# EAGLE design Shematic2 (EAGLE 9.0.0)
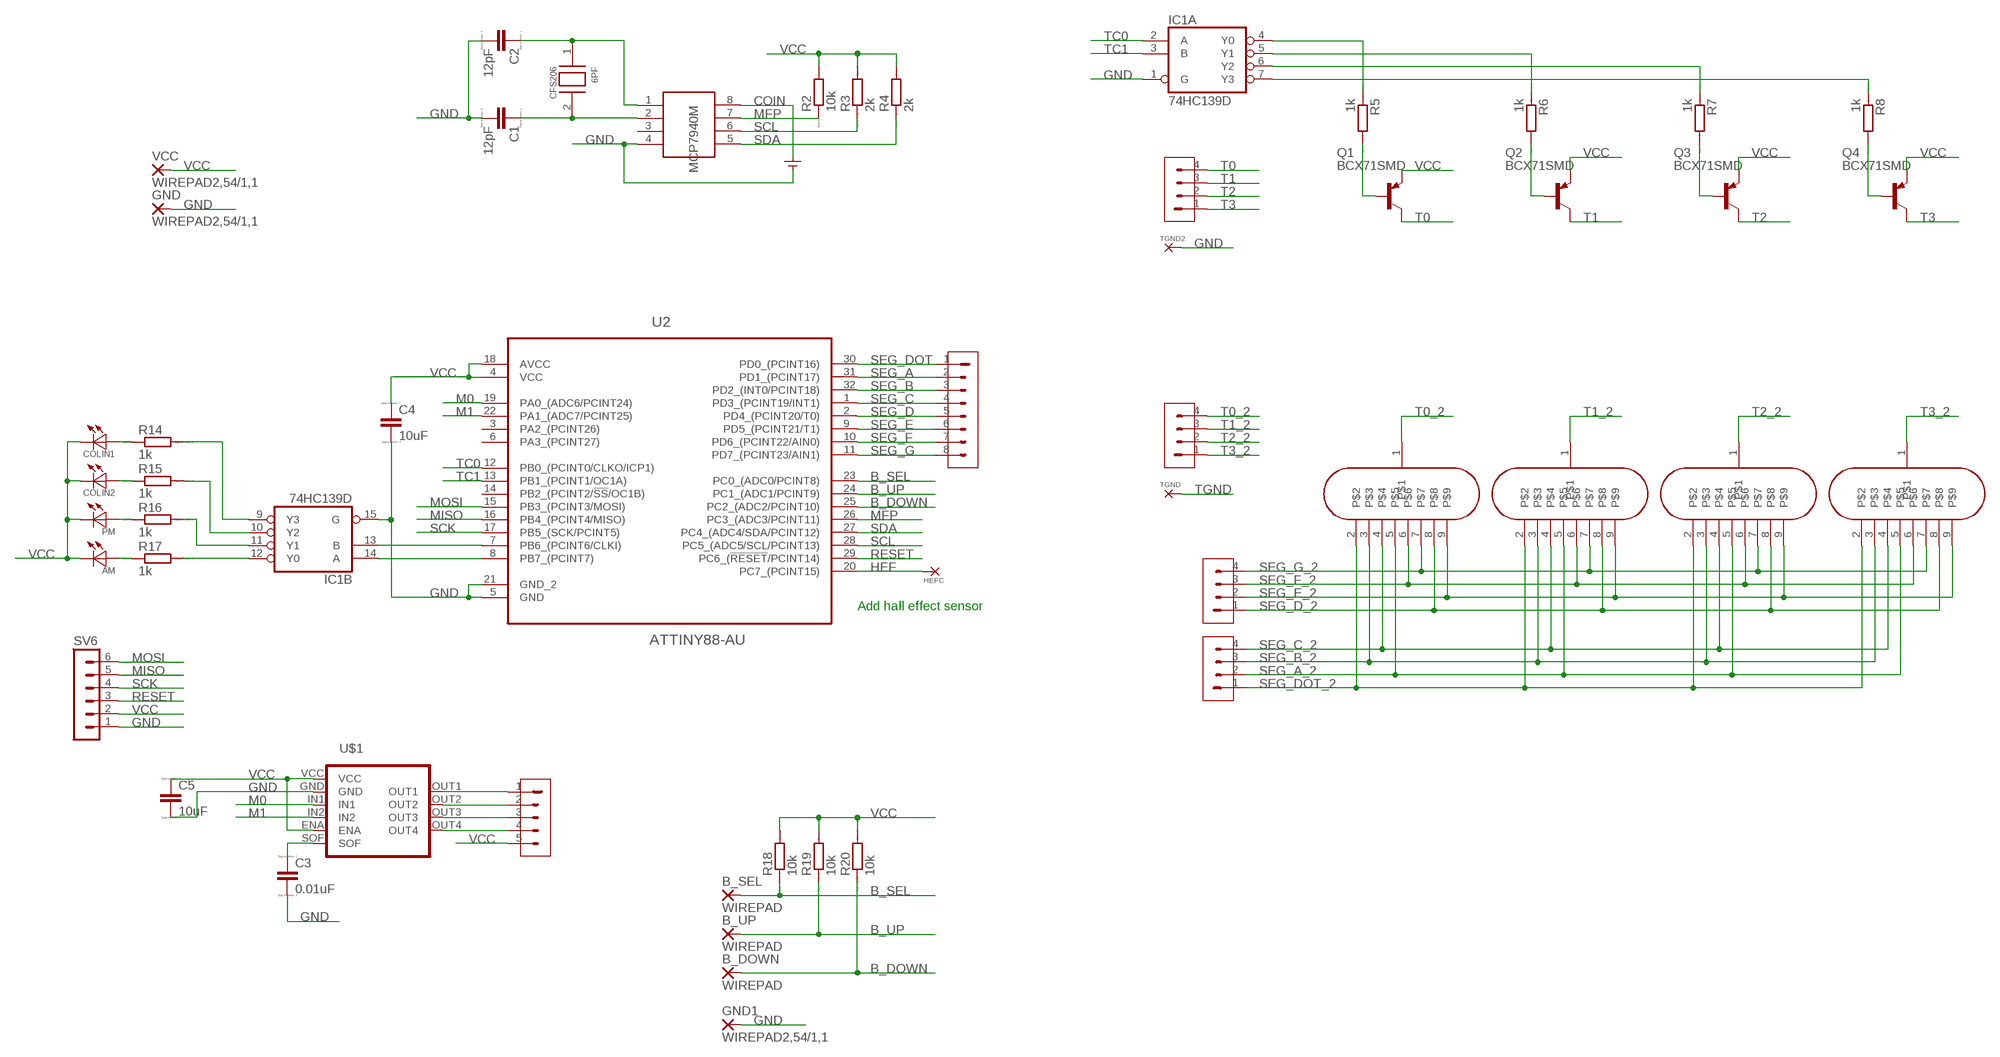
[diagram p0: schematic, sheet 1]

## Parts
6PF  CFS206  [CFS206]
AM  LED  [LED]
B_DOWN  WIREPAD  WIREPAD2,54/1,1  [2,54/1,1]
B_SEL  WIREPAD  WIREPAD2,54/1,1  [2,54/1,1]
B_UP  WIREPAD  WIREPAD2,54/1,1  [2,54/1,1]
C1  12pF  CC1206  [C1206]
C2  12pF  CC1206  [C1206]
C3  0.01uF  CC1206  [C1206]
C4  10uF  CC1206  [C1206]
C5  10uF  CC1206  [C1206]
COLIN1  LED  [LED]
COLIN2  LED  [LED]
GND  WIREPAD2,54/1,1  [2,54/1,1]
GND1  WIREPAD2,54/1,1  [2,54/1,1]
HEFC  H01  [H01]
IC1  74HC139D  [SO16]
MCP7940M  SOIC-8  [SOIC-8]
PM  LED  [LED]
Q1  BCX71SMD  [SOT23]
Q2  BCX71SMD  [SOT23]
Q3  BCX71SMD  [SOT23]
Q4  BCX71SMD  [SOT23]
R2  10k  RR1206  [R1206]
R3  2k  RR1206  [R1206]
R4  2k  RR1206  [R1206]
R5  1k  RR1206  [R1206]
R6  1k  RR1206  [R1206]
R7  1k  RR1206  [R1206]
R8  1k  RR1206  [R1206]
R14  1k  RR1206  [R1206]
R15  1k  RR1206  [R1206]
R16  1k  RR1206  [R1206]
R17  1k  RR1206  [R1206]
R18  10k  RR1206  [R1206]
R19  10k  RR1206  [R1206]
R20  10k  RR1206  [R1206]
SV1  H08  [H08]
SV2  H04  [H04]
SV3  H04  [H04]
SV4  H05  [H05]
SV5  H04  [H04]
SV6  MA06-1  [MA06-1]
SV7  H04  [H04]
TGND  H01  [H01]
TGND2  H01  [H01]
TUBE0  IV-9  [IV-9]
TUBE1  IV-9  [IV-9]
TUBE2  IV-9  [IV-9]
TUBE3  IV-9  [IV-9]
U2  ATTINY88-AU  [QFP80P900X900X120-32N]
U$1  LB1848MC  [LB1848MC]
U$5  COIN  [COIN]
VCC  WIREPAD2,54/1,1  [2,54/1,1]

## Nets
B_DOWN: B_DOWN.1(P) R20.1 U2.25(PC2_(ADC2/PCINT10))
B_SEL: B_SEL.1(P) R18.1 U2.23(PC0_(ADC0/PCINT8))
B_UP: B_UP.1(P) R19.1 U2.24(PC1_(ADC1/PCINT9))
COIN: MCP7940M.8 U$5.V+
GND: C1.2 C2.2 C3.2 C4.2 C5.2 GND1.1(P) GND.1(P) IC1.1(A:G) IC1.15(B:G) MCP7940M.4 SV6.1 TGND2.P$1 U2.5(GND) U2.21(GND_2) U$1.GND U$5.V-
HEF: HEFC.P$1 U2.20(PC7_(PCINT15))
M0: U2.19(PA0_(ADC6/PCINT24)) U$1.IN1
M1: U2.22(PA1_(ADC7/PCINT25)) U$1.IN2
MFP: MCP7940M.7 R2.1 U2.26(PC3_(ADC3/PCINT11))
MISO: SV6.5 U2.16(PB4_(PCINT4/MISO))
MOSI: SV6.6 U2.15(PB3_(PCINT3/MOSI))
N$1: Q4.1(B) R8.2
N$2: Q3.1(B) R7.2
N$3: Q2.1(B) R6.2
N$4: 6PF.2 C1.1 MCP7940M.2
N$5: Q1.1(B) R5.2
N$6: 6PF.1 C2.1 MCP7940M.1
N$7: COLIN1.P$1 R14.1
N$8: IC1.4(A:Y0) R5.1
N$9: COLIN2.P$1 R15.1
N$10: IC1.5(A:Y1) R6.1
N$11: IC1.6(A:Y2) R7.1
N$12: PM.P$1 R16.1
N$13: IC1.7(A:Y3) R8.1
N$14: AM.P$1 R17.1
N$15: IC1.12(B:Y0) R17.2
N$16: IC1.11(B:Y1) R16.2
N$17: IC1.10(B:Y2) R15.2
N$18: IC1.9(B:Y3) R14.2
N$19: SV4.4 U$1.OUT4
N$20: SV4.3 U$1.OUT3
N$21: SV4.2 U$1.OUT2
N$22: SV4.1 U$1.OUT1
N$27: IC1.13(B:B) U2.7(PB6_(PCINT6/CLKI))
N$28: IC1.14(B:A) U2.8(PB7_(PCINT7))
N$31: C3.1 U$1.SOF
RESET: SV6.3 U2.29(PC6_(!RESET!/PCINT14))
SCK: SV6.4 U2.17(PB5_(SCK/PCINT5))
SCL: MCP7940M.6 R3.1 U2.28(PC5_(ADC5/SCL/PCINT13))
SDA: MCP7940M.5 R4.1 U2.27(PC4_(ADC4/SDA/PCINT12))
SEG_A: SV1.2 U2.31(PD1_(PCINT17))
SEG_A_2: SV7.2 TUBE0.5 TUBE1.5 TUBE2.5 TUBE3.5
SEG_B: SV1.3 U2.32(PD2_(INT0/PCINT18))
SEG_B_2: SV7.3 TUBE0.3 TUBE1.3 TUBE2.3 TUBE3.3
SEG_C: SV1.4 U2.1(PD3_(PCINT19/INT1))
SEG_C_2: SV7.4 TUBE0.4 TUBE1.4 TUBE2.4 TUBE3.4
SEG_D: SV1.5 U2.2(PD4_(PCINT20/T0))
SEG_D_2: SV2.1 TUBE0.8 TUBE1.8 TUBE2.8 TUBE3.8
SEG_DOT: SV1.1 U2.30(PD0_(PCINT16))
SEG_DOT_2: SV7.1 TUBE0.2 TUBE1.2 TUBE2.2 TUBE3.2
SEG_E: SV1.6 U2.9(PD5_(PCINT21/T1))
SEG_E_2: SV2.2 TUBE0.9 TUBE1.9 TUBE2.9 TUBE3.9
SEG_F: SV1.7 U2.10(PD6_(PCINT22/AIN0))
SEG_F_2: SV2.3 TUBE0.6 TUBE1.6 TUBE2.6 TUBE3.6
SEG_G: SV1.8 U2.11(PD7_(PCINT23/AIN1))
SEG_G_2: SV2.4 TUBE0.7 TUBE1.7 TUBE2.7 TUBE3.7
T0: Q1.3(C) SV5.4
T0_2: SV3.4 TUBE0.1
T1: Q2.3(C) SV5.3
T1_2: SV3.3 TUBE1.1
T2: Q3.3(C) SV5.2
T2_2: SV3.2 TUBE2.1
T3: Q4.3(C) SV5.1
T3_2: SV3.1 TUBE3.1
TC0: IC1.2(A:A) U2.12(PB0_(PCINT0/CLKO/ICP1))
TC1: IC1.3(A:B) U2.13(PB1_(PCINT1/OC1A))
TGND: TGND.P$1
VCC: AM.P$2 C4.1 C5.1 COLIN1.P$2 COLIN2.P$2 PM.P$2 Q1.2(E) Q2.2(E) Q3.2(E) Q4.2(E) R2.2 R3.2 R4.2 R18.2 R19.2 R20.2 SV4.5 SV6.2 U2.4(VCC) U2.18(AVCC) U$1.ENA U$1.VCC VCC.1(P)
Unconnected: MCP7940M.3 U2.3(PA2_(PCINT26)) U2.6(PA3_(PCINT27)) U2.14(PB2_(PCINT2/!SS!/OC1B))

## Notes on the sheet
- Add hall effect sensor

## Power pins joined to a net without a drawn wire
GND: IC1.8(P:GND)
VCC: IC1.16(P:VCC)

## Library data of the parts
6PF = Library:CFS206
AM COLIN1 COLIN2 PM = Library:LED
B_DOWN B_SEL B_UP GND GND1 VCC = wirepad:WIREPAD: Wire PAD connect wire on PCB
C1-C5 = eagle-ltspice:C: CAPACITOR, European symbol; SPICEMODEL: NONE; SPICEPREFIX: C
HEFC TGND TGND2 = Library:H01
IC1 = 74xx-eu:74*139: Dual 2-line to 4-line DECODER/DEMULTIPLEXER
MCP7940M = smd-footprints:SOIC-8
Q1-Q4 = transistor-pnp:BCX71SMD: PNP Transistor
R2-R8 R14-R20 = eagle-ltspice:R: RESISTOR, European symbol; SPICEMODEL: NONE; SPICEPREFIX: R
SV1 = Library:H08
SV2 SV3 SV5 SV7 = Library:H04
SV4 = Library:H05
SV6 = con-lstb:MA06-1: PIN HEADER; OC_FARNELL: unknown; OC_NEWARK: unknown
TUBE0 TUBE1-TUBE3 = Library:IV-9
U2 = Library:ATTINY88-AU: IC, 8BIT MCU, AVR Tiny, 12MHZ, TQFP-32; MPN: ATTINY88-AU; OC_FARNELL: 1704570; OC_NEWARK: 68T3851; PACKAGE: TQFP-32; SUPPLIER: ATMEL
U$1 = Library:LB1848MC
U$5 = Library:COIN

## Board
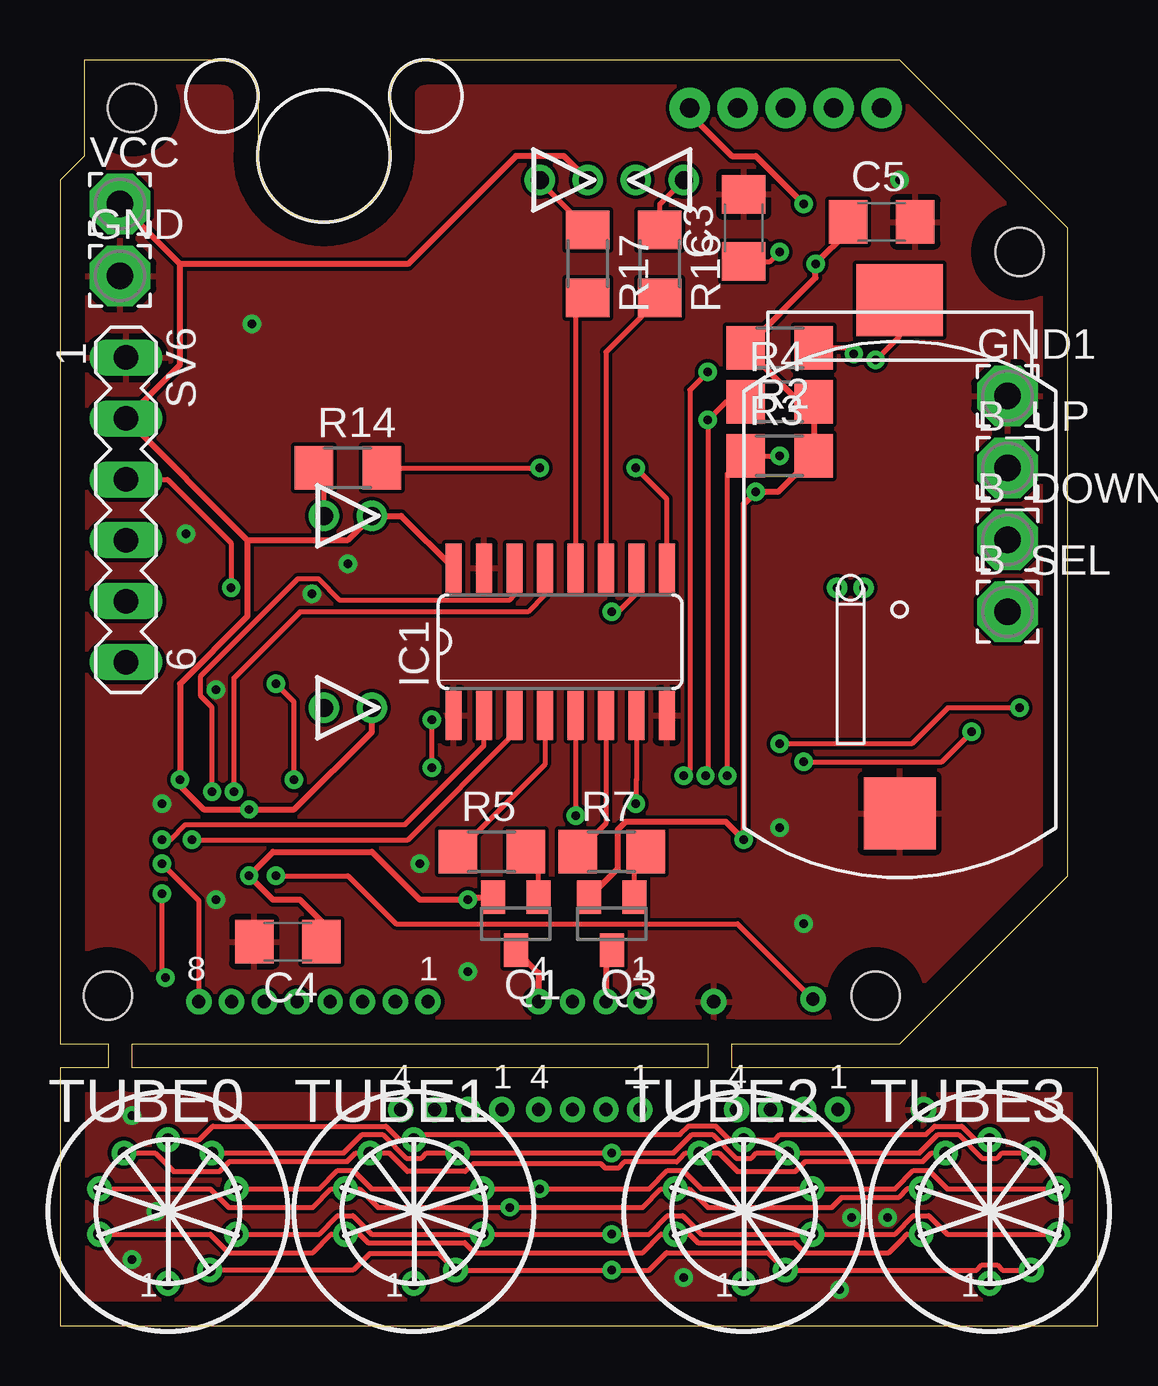
[diagram p1: board, top side]
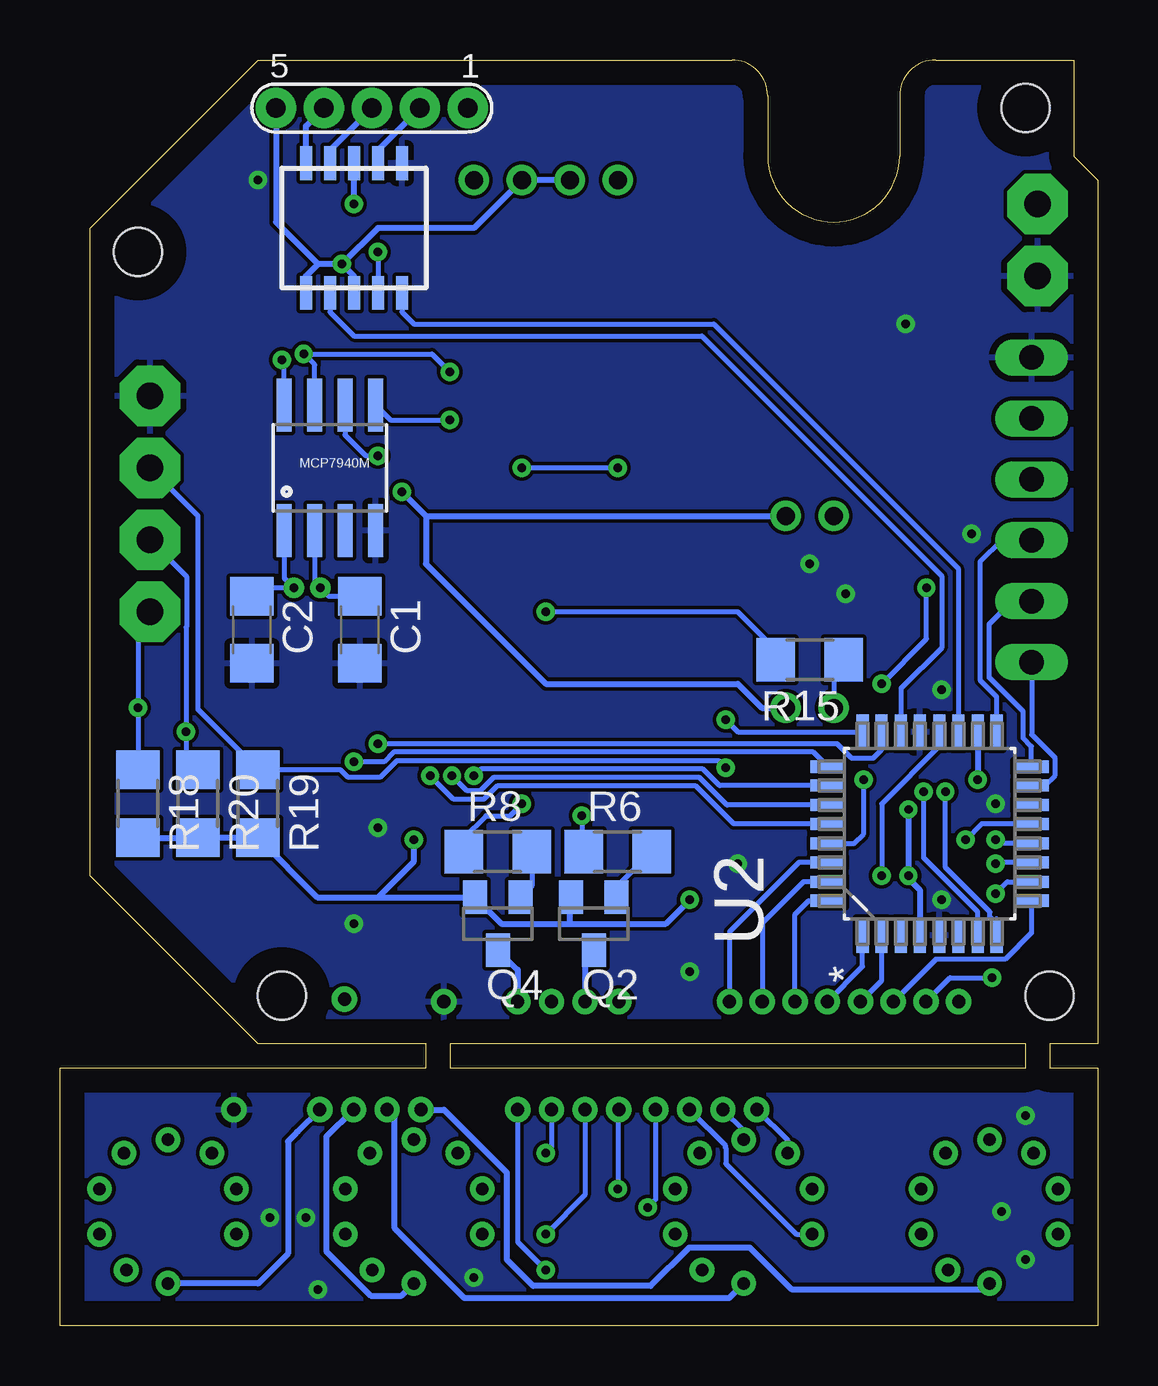
[diagram p2: board, bottom side, seen from below]

Size 43.25 x 52.75 mm. Coordinates in mm from the lower left corner, seen from the top.
Outline: 0,11.75 2,11.75 2,10.75 0,10.75 0,0 43.25,0 43.25,10.75 28,10.75 28,11.75 35,11.75 42,18.75 42,45.75 35,52.75 15.25,52.75 arc90 13.75,51.25 13.75,48.75 arc-180 8.25,48.75 8.25,51.25 arc90 6.75,52.75 1,52.75 1,48.75 0,47.75 0,11.75
Outline: 27,10.75 3,10.75 3,11.75 27,11.75 27,10.75
Copper layers (1*16): Top 0.035mm / dielectric 1.5mm / Bottom 0.035mm
Design rules "default": minimum track width 6mil, minimum drill 0.35mm, track to track 6mil, track to pad 6mil, pad to pad 6mil, via to via 6mil, smd to smd 6mil, copper to edge 40mil, drill to drill 6mil, minimum pad ring 10mil, minimum via ring 8mil, stop-mask expansion 4mil, vias tented up to drill 0mil, thermal gap 10mil
Holes 2 mm at 2,13.75 34,13.75 40,44.75 3,50.75

### Footprints (pad centres in the part's own frame; a part is rotated, then mirrored left to right if it is on the bottom)
CFS206 = drill 0.35: 1 0,0; 2 1.1,0
LED = drill 0.75: P$1 -1,0; P$2 1,0
2,54/1,1 = drill 1.118 pad 2.54 octagon: 1 0,0
C1206 = smd 1.6 x 1.8: 1 -1.4,0; 2 1.4,0
H01 = drill 0.55: P$1 0,0
SO16 = smd 0.66 x 2.032: 1 -4.445,-3.073; 2 -3.175,-3.073; 3 -1.905,-3.073; 4 -0.635,-3.073; 5 0.635,-3.073; 6 1.905,-3.073; 7 3.175,-3.073; 8 4.445,-3.073; 9 4.445,3.073; 10 3.175,3.073; 11 1.905,3.073; 12 0.635,3.073; 13 -0.635,3.073; 14 -1.905,3.073; 15 -3.175,3.073; 16 -4.445,3.073
SOIC-8 = smd 0.61 x 2.21: 1 -1.905,-2.616; 2 -0.635,-2.616; 3 0.635,-2.616; 4 1.905,-2.616; 5 1.905,2.616; 6 0.635,2.616; 7 -0.635,2.616; 8 -1.905,2.616
SOT23 = smd 1 x 1.4: 1 -0.95,-1.1; 2 0.95,-1.1; 3 0,1.1
R1206 = smd 1.6 x 1.803: 1 -1.422,0; 2 1.422,0
H08 = drill 0.55: 1 4.841,0; 2 3.476,0; 3 2.111,0; 4 0.762,0; 5 -0.619,0; 6 -1.984,0; 7 -3.349,0; 8 -4.714,0
H04 = drill 0.55: 1 2.174,0; 2 0.762,0; 3 -0.635,0; 4 -2.048,0
H05 = drill 0.8 pad 1.676: 1 4,0; 2 2,0; 3 0,0; 4 -2,0; 5 -4,0
MA06-1 = drill 1.016 long: 1 -6.35,0; 2 -3.81,0; 3 -1.27,0; 4 1.27,0; 5 3.81,0; 6 6.35,0
IV-9 = drill 0.525: 1 0,-2.994; 2 1.736,-2.441; 3 2.85,-0.943; 4 2.85,0.943; 5 1.836,2.441; 6 0,2.994; 7 -1.836,2.441; 8 -2.85,0.943; 9 -2.85,-0.943
QFP80P900X900X120-32N = smd 1.473 x 0.508: 1 -4.242,2.794; 2 -4.242,2.007; 3 -4.242,1.194; 4 -4.242,0.406; 5 -4.242,-0.406; 6 -4.242,-1.194; 7 -4.242,-2.007; 8 -4.242,-2.794; 17 4.242,-2.794; 18 4.242,-2.007; 19 4.242,-1.194; 20 4.242,-0.406; 21 4.242,0.406; 22 4.242,1.194; 23 4.242,2.007; 24 4.242,2.794 | smd 0.508 x 1.473: 9 -2.794,-4.242; 10 -2.007,-4.242; 11 -1.194,-4.242; 12 -0.406,-4.242; 13 0.406,-4.242; 14 1.194,-4.242; 15 2.007,-4.242; 16 2.794,-4.242; 25 2.794,4.242; 26 2.007,4.242; 27 1.194,4.242; 28 0.406,4.242; 29 -0.406,4.242; 30 -1.194,4.242; 31 -2.007,4.242; 32 -2.794,4.242
LB1848MC = smd 0.5 x 1.4: ENA 0,-2.7; GND 2,2.7; IN1 2,-2.7; IN2 -1,-2.7; OUT1 0,2.7; OUT2 1,2.7; OUT3 -1,2.7; OUT4 -2,2.7; SOF 1,-2.7; VCC -2,-2.7
COIN = smd 3.6 x 3: V+ 0,-1.5 | smd 3 x 3: V- 0,19.9

### Placement (x,y rotation side)
6PF  33.5,30.75 180 top
AM  21,47.75 0 top
B_DOWN  39.5,32.75 0 top
B_SEL  39.5,29.75 0 top
B_UP  39.5,35.75 0 top
C1  30.75,29 270 bottom
C2  35.25,29 270 bottom
C3  28.5,45.75 90 top
C4  9.5,16 180 top
C5  34.25,46 0 top
COLIN1  12,33.75 0 top
COLIN2  12,25.75 0 top
GND  2.5,43.75 0 top
GND1  39.5,38.75 0 top
HEFC  31.39,13.6 0 top
IC1  20.85,28.5 0 top
MCP7940M  32,35.75 0 bottom
PM  25,47.75 180 top
Q1  19,16.75 180 top
Q2  21,16.75 180 bottom
Q3  23,16.75 180 top
Q4  25,16.75 180 bottom
R2  30,40.75 180 top
R3  30,36.25 0 top
R4  30,38.5 0 top
R5  18,19.75 0 top
R6  20,19.75 0 bottom
R7  23,19.75 0 top
R8  25,19.75 0 bottom
R14  12,35.75 0 top
R15  12,27.75 180 bottom
R16  25,44.25 270 top
R17  22,44.25 270 top
R18  40,21.75 270 bottom
R19  35,21.75 270 bottom
R20  37.5,21.75 270 bottom
SV1  10.5,13.5 0 top
SV2  16.25,9 0 top
SV3  30.25,9 0 top
SV4  30.25,50.75 0 bottom
SV5  22,13.5 0 top
SV6  2.75,34 270 top
SV7  22,9 0 top
TGND  36,9 0 top
TGND2  27.25,13.5 0 top
TUBE0  4.5,4.75 0 top
TUBE1  14.75,4.75 0 top
TUBE2  28.5,4.75 0 top
TUBE3  38.75,4.75 0 top
U2  7,20.5 90 bottom
U$1  31,45.75 0 bottom
U$5  35,41.25 180 top
VCC  2.5,46.75 0 top

### Tracks (layer width: path | path; a pad name or v marks a point on that pad's centre or on a via)
B_DOWN  (via drill 0.35)
  Top 0.2: v31,23.5 36.75,23.5 v38,24.75
  Bottom 0.2: B_DOWN.1 37.98,31.23 37.98,29.12 38,29.1 v38,24.75 38,23.67 R20.1 | U2.25 11.84,23.9 29.35,23.9 29.75,23.5 v31,23.5
B_SEL  (via drill 0.35)
  Top 0.2: v40,25.75 37,25.75 35.5,24.25 v30,24.25
  Bottom 0.2: B_SEL.1 40,29.25 v40,25.75 R18.1 | U2.23 9.01,23.99 9.35,23.65 10.25,23.65 10.85,24.25 15,24.25 15.11,24.25 15.89,24.25 16,24.25 v30,24.25
B_UP  (via drill 0.35)
  Top 0.2: v15.5,23.25 v15.5,25.25
  Bottom 0.2: B_UP.1 37.5,33.75 37.5,25.67 R19.1 | R19.1 34.58,22.75 | v15.5,25.25 14.99,24.74 U2.24 | v15.5,23.25 15.8,23.55 29.2,23.55 29.88,22.87 31.26,22.87 31.56,23.17 R19.1
COIN  (via drill 0.35)
  Top 0.2: v34,40.25 35,41.25 U$5.V+
  Bottom 0.2: MCP7940M.8 33.91,40.16 v34,40.25
GND  (via drill 0.35)
  other vias: 15,19.25 30,20.75 8,41.75 6.5,17.75 17,14.75 6.5,26.5 10.5,30.5 31,16.75 5.25,33 12,31.75 4.25,21.75 35,47.75
  pour Bottom: 0,50.75 1,50.75 1,52.75 6.75,52.75 arc-90 8.25,51.25 8.25,48.75 arc180 13.75,48.75 13.75,51.25 arc-90 15.25,52.75 35,52.75 42,45.75 42,18.75 35,11.75 0,11.75 0,47.75 1,48.75 1,49.75 0,49.75
  pour Top: 0,52.75 6.75,52.75 arc-90 8.25,51.25 8.25,48.75 arc180 13.75,48.75 13.75,51.25 arc-90 15.25,52.75 35,52.75 42,45.75 42,18.75 35,11.75 0,11.75 0,47.75 1,48.75 1,51.75 0,51.75
HEF  (via drill 0.35)
  Top 0.2: HEFC.P$1 28.24,16.75 14,16.75 12,18.75 v9,18.75
  Bottom 0.2: U2.20 6.59,24.16 9,21.75 v9,18.75
M0
  Bottom 0.2: U2.19 5.81,31.56 16,41.75 28.5,41.75 29,42.25 U$1.IN1
M1
  Bottom 0.2: U$1.IN2 32,42.25 31,41.25 16.5,41.25 6.5,31.25 6.5,28.25 8.19,26.56 U2.22
MFP  (via drill 0.35)
  Top 0.2: 26.62,39.37 v27,39.75 26.25,39 26.25,23.16 v26,22.91 | v33.09,40.5 32.84,40.75 R2.1
  Bottom 0.2: U2.26 15.76,22.51 16.44,23.19 25.72,23.19 v26,22.91 | v27,39.75 27.75,40.5 v33.09,40.5 32.63,40.04 MCP7940M.7
MISO
  Bottom 0.2: U2.16 2.76,24.14 3.1,24.49 3.1,25.6 4.53,27.03 4.53,29.22 3.56,30.19 SV6.5
MOSI
  Bottom 0.2: SV6.6 2.75,24.63 1.77,23.65 1.77,22.93 2.2,22.51 U2.15
N$1
  Bottom 0.2: R8.2 23.58,18.32 Q4.1
N$2
  Top 0.2: Q3.1 23.95,19.28 R7.2
N$3
  Bottom 0.2: R6.2 20.05,18.28 Q2.1
N$4
  Bottom 0.2: MCP7940M.2 32.63,30.98 6PF.2 32.05,30.4 C1.1
N$5
  Top 0.2: Q1.1 19.95,19.22 R5.2
N$6
  Bottom 0.2: MCP7940M.1 33.91,31.16 6PF.1 34.9,30.75 C2.1
N$7
  Top 0.2: COLIN1.P$1 11,35.33 R14.1
N$8
  Top 0.2: IC1.4 20.22,23.39 R5.1
N$9
  Bottom 0.2: R15.1 11,27.33 COLIN2.P$1
N$10  (via drill 0.35)
  Top 0.2: v21.5,21.25 21.48,21.27 IC1.5
  Bottom 0.2: R6.1 21.5,19.83 v21.5,21.25
N$11
  Top 0.2: IC1.6 22.76,20.93 R7.1
N$12
  Top 0.2: R16.1 25,46.75 PM.P$1
N$13  (via drill 0.35)
  Top 0.2: IC1.7 24.02,22.75 24.02,22.73 24.02,21.77 v24,21.75
  Bottom 0.2: R8.1 26.42,20.33 25.5,21.25 24.5,21.25 v24,21.75
N$14
  Top 0.2: AM.P$1 20,47.67 R17.1
N$15
  Top 0.2: R17.2 21.48,42.31 IC1.12
N$16
  Top 0.2: R16.2 22.76,40.58 IC1.11
N$17  (via drill 0.35)
  Top 0.2: IC1.10 24,31.55 24,30.5 23.25,29.75 v23,29.75
  Bottom 0.2: v23,29.75 15,29.75 13.42,28.17 R15.2
N$18  (via drill 0.35)
  Top 0.2: R14.2 v20,35.75 | IC1.9 25.3,34.45 v24,35.75
  Bottom 0.2: v20,35.75 v24,35.75
N$19
  Bottom 0.254: U$1.OUT4 33,50 SV4.4
N$20
  Bottom 0.254: U$1.OUT3 32,49 SV4.3
N$21
  Bottom 0.254: SV4.2 30,49 U$1.OUT2
N$22  (via drill 0.35)
  Top 0.254: SV4.1 26.25,50.5 28,48.75 29,48.75 v31,46.75
  Bottom 0.254: v31,46.75 U$1.OUT1
N$27  (via drill 0.35)
  Top 0.2: IC1.13 20.22,30.47 19.5,29.75 10,29.75 7.25,27 v7.25,22.25
  Bottom 0.2: U2.7 4.99,16.75 | 4.99,16.75 4.99,16.99 | v7.25,22.25 7.25,19.5 5,17.25 5,16.76 4.99,16.75
N$28  (via drill 0.35)
  Top 0.2: IC1.14 18.95,30.45 18.75,30.25 11.64,30.25 10.76,31.13 9.92,31.13 5.87,27.08 5.87,26.24 6.34,25.77 v6.34,22.25
  Bottom 0.2: U2.8 4.21,16.75 | 4.21,16.75 4.21,16.96 | 4.21,16.75 4.49,17.03 4.49,17.23 6.34,19.09 v6.34,22.25
N$31  (via drill 0.35)
  Top 0.2: C3.1 29.6,44.35 v30,44.75
  Bottom 0.2: v30,44.75 U$1.SOF
RESET  (via drill 0.35)
  Top 0.2: v9.75,22.75 9.75,26 v9,26.75 | 3.48,35.27 SV6.3 4.48,35.27 7.13,32.62 v7.13,30.75
  Bottom 0.2: U2.29 10.16,20.09 9.75,20.5 v9.75,22.75 | v9,26.75 7.13,28.62 v7.13,30.75
SCK
  Bottom 0.2: SV6.4 3.98,32.73 4,32.75 4.88,31.87 4.88,26.88 4.21,26.21 U2.17
SCL  (via drill 0.35)
  Top 0.2: v27.82,22.91 27.82,35.49 R3.1 v30,36.25
  Bottom 0.2: MCP7940M.6 31.37,37.12 30.5,36.25 v30,36.25 | U2.28 15.16,20.91 16.74,22.49 25.04,22.49 25.59,21.93 26.84,21.93 v27.82,22.91
SDA  (via drill 0.35)
  Top 0.2: 28,38.5 R4.1 27.75,38.5 v27,37.75 27,23.01 v26.91,22.91
  Bottom 0.2: MCP7940M.5 29.48,37.75 v27,37.75 | U2.27 15.44,21.69 16.59,22.84 25.18,22.84 25.74,22.28 26.28,22.28 v26.91,22.91
SEG_A
  Bottom 0.2: U2.31 12.26,18.49 13.98,16.77 SV1.2
SEG_A_2  (via drill 0.35)
  Top 0.2: TUBE0.5 11.83,7.19 12.6,7.96 13.45,7.96 14.43,6.98 15.07,6.98 15.28,7.19 TUBE1.5 v23,7.19 25.58,7.19 26.35,7.96 27.2,7.96 28.18,6.98 28.82,6.98 29.03,7.19 TUBE2.5 35.83,7.19 36.6,7.96 37.45,7.96 38.43,6.98 39.07,6.98 39.28,7.19 TUBE3.5
  Bottom 0.2: SV7.2 22.76,7.43 v23,7.19
SEG_B
  Bottom 0.2: SV1.3 12.61,17.14 12.04,17.71 U2.32
SEG_B_2  (via drill 0.35)
  Top 0.2: TUBE0.3 10.81,3.81 11.58,4.57 12.22,4.57 12.99,3.81 TUBE1.3 v23,3.81 24.56,3.81 25.33,4.57 25.97,4.57 26.74,3.81 TUBE2.3 34.81,3.81 35.58,4.57 36.22,4.57 36.99,3.81 TUBE3.3
  Bottom 0.2: SV7.3 21.37,5.44 v23,3.81
SEG_C
  Bottom 0.2: SV1.4 9.79,14.97 U2.1
SEG_C_2  (via drill 0.35)
  Top 0.2: TUBE0.4 10.81,5.69 11.58,6.46 12.22,6.46 12.99,5.69 TUBE1.4 v20,5.69 24.56,5.69 25.33,6.46 25.97,6.46 26.74,5.69 TUBE2.4 34.81,5.69 35.58,6.46 36.22,6.46 36.99,5.69 TUBE3.4
  Bottom 0.2: SV7.4 20,8.95 v20,5.69
SEG_D
  Bottom 0.2: U2.2 9.01,14.37 SV1.5
SEG_D_2  (via drill 0.35)
  Top 0.2: TUBE0.8 6.26,5.69 7.03,4.93 10.54,4.93 11.31,5.69 TUBE1.8 12.49,5.69 13.26,4.93 v18.75,4.93 24.29,4.93 25.06,5.69 TUBE2.8 26.24,5.69 27.01,4.93 32.17,4.93 32.59,5.34 34.96,5.34 35.31,5.69 TUBE3.8
  Bottom 0.2: SV2.1 18.42,5.25 v18.75,4.93
SEG_DOT
  Bottom 0.2: U2.30 12.44,19.31 15.34,16.41 SV1.1
SEG_DOT_2  (via drill 0.35)
  Top 0.2: TUBE0.2 12.22,2.31 12.91,3 15.8,3 TUBE1.2 v23,2.31 24.56,2.31 25.29,3.04 29.51,3.04 TUBE2.2 38.22,2.31 38.43,2.52 39.07,2.52 39.28,2.31 TUBE3.2
  Bottom 0.2: SV7.1 24.17,3.48 v23,2.31
SEG_E
  Bottom 0.2: SV1.6 6.75,15.27 3.85,15.27 2.76,16.36 U2.9
SEG_E_2
  Top 0.2: TUBE0.9 6.26,3.81 7.03,3.04 10.54,3.04 11.31,3.81 TUBE1.9 12.49,3.81 12.84,3.45 16.86,3.45 17.28,3.04 24.29,3.04 25.06,3.81 TUBE2.9 26.24,3.81 26.59,3.45 30.62,3.45 31.03,3.04 34.54,3.04 35.13,3.62 35.31,3.81 TUBE3.9
  Bottom 0.2: SV2.2 15.52,7.51 15.52,7.43 15.5,7.41 15.5,6.75 12.56,3.81 TUBE1.9
SEG_F  (via drill 0.35)
  Top 0.2: v4.39,14.5 4.25,14.64 v4.25,18
  Bottom 0.2: SV1.7 6.15,14.5 v4.39,14.5 | v4.25,18 3.76,18.49 U2.10
SEG_F_2
  Top 0.2: TUBE0.6 5.8,7.74 6.37,8.31 13.59,8.31 14.16,7.74 TUBE1.6 14.96,7.96 25.85,7.96 26.2,8.31 27.34,8.31 27.91,7.74 TUBE2.6 29.8,7.74 30.02,7.96 36.1,7.96 36.45,8.31 37.59,8.31 38.16,7.74 TUBE3.6
  Bottom 0.2: SV2.3 14.75,8.13 TUBE1.6
SEG_G  (via drill 0.35)
  Top 0.2: v4.25,19.25 5.79,17.71 SV1.8
  Bottom 0.2: U2.11 4.19,19.31 v4.25,19.25
SEG_G_2
  Top 0.2: TUBE0.7 3.97,7.19 4.73,6.42 6.65,6.42 7.07,6.84 11.97,6.84 12.32,7.19 TUBE1.7 13.72,7.19 14.49,6.42 16.9,6.42 17.23,6.75 22.55,6.75 22.74,6.56 23.26,6.56 23.52,6.81 25.7,6.81 25.72,6.84 25.82,6.93 26.08,7.19 TUBE2.7 27.47,7.19 28.24,6.42 30.65,6.42 31.07,6.84 35.97,6.84 36.33,7.19 TUBE3.7
  Bottom 0.2: SV2.4 12.91,7.71 TUBE1.7
T0
  Top 0.254: Q1.3 19.95,14.7 SV5.4
T0_2
  Bottom 0.254: TUBE0.1 4.74,1.51 12.76,1.51 14.5,3.25 17.03,3.25 18.63,1.65 23.52,1.65 24.62,2.75 24.62,6.37 27.25,9 SV3.4
T1
  Bottom 0.254: Q2.3 21.37,15.29 SV5.3
T1_2
  Bottom 0.254: TUBE1.1 15.36,1.14 26.39,1.14 29.3,4.05 29.3,8.68 SV3.3
T2
  Top 0.254: Q3.3 22.76,15.41 SV5.2
T2_2
  Bottom 0.254: TUBE2.1 29.01,1.25 30.3,1.25 32.15,3.09 32.15,7.87 SV3.2
T3
  Bottom 0.254: Q4.3 24.17,14.82 SV5.1
T3_2
  Bottom 0.254: TUBE3.1 35.01,1.76 35,1.75 33.75,3 33.75,7.67 33.5,7.92 33.34,8.09 SV3.1
TC0  (via drill 0.35)
  Top 0.2: v4.25,20.25 4.61,20.25 5.24,20.88 12,20.88 14.38,20.88 17.68,24.18 IC1.2
  Bottom 0.2: U2.12 4.09,20.09 v4.25,20.25
TC1  (via drill 0.35)
  Top 0.2: IC1.3 18.95,24.7 14.5,20.25 v5.5,20.25
  Bottom 0.2: 2.91,20.75 U2.13 4.84,20.91 v5.5,20.25
TGND  (via drill 0.35)
  other vias: 34.5,4.5 33,4.5 32.5,1.5 3,2.75 4,4.75 3,8.75 26,2
  pour Bottom: 0,10.75 0,0 43.25,0 43.25,10.75
  pour Top: 0,10.75 0,0 43.25,0 43.25,10.75
VCC  (via drill 0.35)
  Top 0.254: Q1.2 17.1,17.85 v17,17.75 15,17.75 13,19.75 8.88,19.75 v7.88,18.75 8.88,17.75 10,17.75 10.9,16.85 C4.1 | 5,44.25 VCC.1 | 5,44.25 5,40.06 SV6.2 7.81,32.75 | COLIN2.P$2 13,24.75 9.76,21.51 v7.88,21.51 5.99,21.51 5,22.5 v5,22.75 5,26.75 7.81,29.56 7.81,32.75 | IC1.16 14.23,33.75 COLIN1.P$2 12,32.75 7.81,32.75 | Q3.2 23.25,19.05 23.25,20.68 23.58,21 27.75,21 v28.5,20.25 28.5,34.25 v29,34.75 29.92,34.75 R3.2 R4.2 30.83,38.5 R2.2 31.5,43.67 v31.5,44.25 32.85,45.6 C5.1 | 5,44.25 14.5,44.25 19,48.75 21,48.75 AM.P$2
  Bottom 0.2: 22,16.75 22.02,16.73
  Bottom 0.254: U$1.VCC 33,43.75 32.5,44.25 | U$1.ENA 31,43.75 v31.5,44.25 | v31.5,44.25 32.5,44.25 | SV4.5 34.25,46 32.5,44.25 | AM.P$2 PM.P$2 26,45.75 30,45.75 v31.5,44.25 | v31.5,44.25 | v17,17.75 18,16.75 22,16.75 | 22,16.75 24.85,16.75 Q4.2 30,17.85 | 22,16.75 22,17.7 22.05,17.75 Q2.2 | R18.2 R20.2 R19.2 32.52,17.85 30,17.85 | U2.18 v4.99,22.76 v5,22.75 | v7.88,21.51 v7.88,18.75 7.88,18.63 7.41,18.16 U2.4 | v29,34.75 28,33.75 | 28,33.75 COLIN1.P$2 | 28,33.75 28,31.75 23,26.75 15,26.75 14,25.75 COLIN2.P$2 | 30,17.85 28.5,19.35 v28.5,20.25

### Text on the board
Measures: Top | Bottom